# Altium schematic sheet Dual_LoadSwitch_Driver.SchDoc
size A4; SheetNumber: 9; SheetTotal: 14
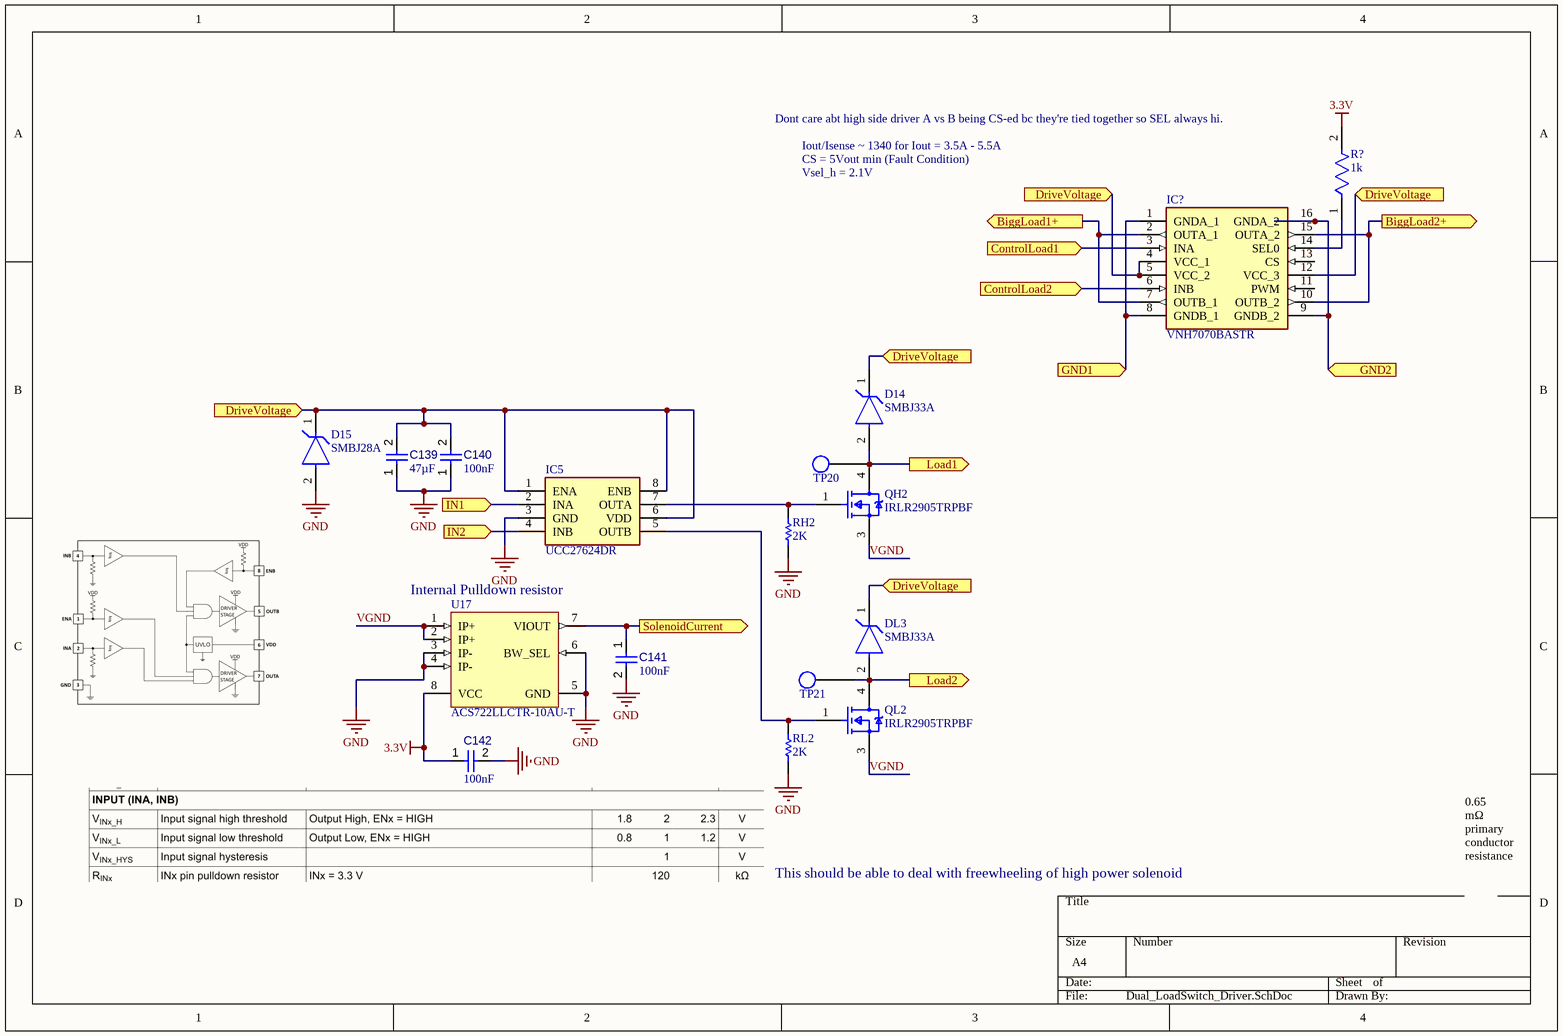
[diagram p0: Dual_LoadSwitch_Driver.SchDoc]

## Parts
C139  value 47µF  [CAPC0805(2012)145_L]  (hidden comment: Capacitor 47µF +/-40% 6.3V 0805)
C140  value 100nF  [CAPC2013X95X50LL10T25]  (hidden comment: Capacitor 100 nF +/-10% 50 V 0805)
C141  value 100nF  [CAPC1005X56X25LL10T15]  (hidden comment: Capacitor 0.1 uF +/- 5% 16 V 0402)
C142  value 100nF  [CAPC1005X56X25LL10T15]  (hidden comment: Capacitor 0.1 uF +/- 5% 16 V 0402)
D14  SMBJ33A  [FP-SMBJ-MFG]
D15  SMBJ28A  [FP-SMBJ-MFG]
DL3  SMBJ33A  [FP-SMBJ-MFG]
IC5  UCC27624DR  [SOIC127P600X175-8N]
IC?  VNH7070BASTR  [SOIC127P600X175-16N]
QH2  IRLR2905TRPBF  [FP-PG-TO252-3-MFG]
QL2  IRLR2905TRPBF  [FP-PG-TO252-3-MFG]
R?  1k  [FP-CRCW0603-e3-MFG]
RH2  2K  [RESC1609X50X30ML10T20]
RL2  2K  [RESC1609X50X30ML10T20]
TP20  BURPG_TestPoint1  [BURPG_TestPoint1]  (value not drawn)  (no BOM)
TP21  BURPG_TestPoint1  [BURPG_TestPoint1]  (value not drawn)  (no BOM)
U17  ACS722LLCTR-10AU-T  [ALEG-LC-8_V]

## Ports
BiggLoad1+ (out), BiggLoad2+ (out), ControlLoad1 (in), ControlLoad2 (in), DriveVoltage (in), GND1 (in), GND2 (in), IN1 (in), IN2 (in), Load1 (out), Load2 (out), SolenoidCurrent (out)

## Nets
3.3V: C142.1 R?.2 U17.8(VCC)
GND: C139.1 C140.1 C141.2 C142.2 D15.2(A) IC5.3(GND) RH2.1 RL2.1 U17.3(IP-) U17.4(IP-) U17.5(GND) U17.6(BW_SEL)
BiggLoad1+: IC?.2(OUTA_1) IC?.7(OUTB_1) ; port BiggLoad1+
BiggLoad2+: IC?.10(OUTB_2) IC?.15(OUTA_2) ; port BiggLoad2+
ControlLoad1: IC?.3(INA) ; port ControlLoad1
ControlLoad2: IC?.6(INB) ; port ControlLoad2
DriveVoltage: C139.2 C140.2 D14.1(C) D15.1(C) DL3.1(C) IC5.1(ENA) IC5.6(VDD) IC5.8(ENB) IC?.4(VCC_1) IC?.5(VCC_2) IC?.12(VCC_3) ; port DriveVoltage
GND1: IC?.1(GNDA_1) IC?.8(GNDB_1) ; port GND1
GND2: IC?.9(GNDB_2) IC?.16(GNDA_2) ; port GND2
IN1: IC5.2(INA) ; port IN1
IN2: IC5.4(INB) ; port IN2
Load1: D14.2(A) QH2.4(DRAIN) TP20.1 ; port Load1
Load2: DL3.2(A) QL2.4(DRAIN) TP21.1 ; port Load2
SolenoidCurrent: C141.1 U17.7(VIOUT) ; port SolenoidCurrent
VGND: QH2.3(SOURCE) QL2.3(SOURCE) U17.1(IP+) U17.2(IP+)
NetIC5_5: IC5.5(OUTB) QL2.1(GATE) RL2.2
NetIC5_7: IC5.7(OUTA) QH2.1(GATE) RH2.2
NetIC?_14: IC?.14(SEL0) R?.1

Not connected (* = marked no-connect by the designer): IC? 11(PWM) 13(CS)

## Notes on the sheet
- (near R?) Dont care abt high side driver A vs B being CS-ed bc they're tied together so SEL always hi.
- Iout/Isense ~ 1340 for Iout = 3.5A - 5.5A
- CS = 5Vout min (Fault Condition)
- Vsel_h = 2.1V
- (near U17) Internal Pulldown resistor
- This should be able to deal with freewheeling of high power solenoid
- 0.65 mΩ primary conductor resistance

## Library data of the parts
C139 = CMP-001-00082-4: Chip Capacitor, 47µF +/-40%, 6.3V, 0805, Thickness 1.45 mm; Tolerance: 10%; Min Operating Temperature: -55°C; Max Operating Temperature: 85°C; Case/Package: 0805; Pins: 2; Mounting Technology: SMT; Voltage Rating: 6.3V
C140 = CMP-001-00018-6: Chip Capacitor, 100 nF, +/- 10%, 50 V, 0805 (2012 Metric); Capacitor Type: Ceramic; Voltage Rating: 50V; Pins: 2; Max Operating Temperature: 125°C; Min Operating Temperature: -55°C; Mounting Technology: SM; Case/Package: 0805; RoHS Compliant: True; Tolerance: 10%
C141 C142 = CMP-001-00001-6: Chip Capacitor, 0.1 uF, +/- 5%, 16 V, 0402 (1005 Metric); Capacitor Type: Ceramic; Voltage Rating: 16V; Max Operating Temperature: 125°C; Min Operating Temperature: -55°C; Case/Package: 0402; Mounting Technology: SM; Pins: 2; Tolerance: 5%; RoHS Compliant: True
D14 DL3 = CMP-2000-07095-2: TVS DIODE 33V 53.3V DO214AA; Manufacturer: Littelfuse Inc; Max Junction Temp: +150°C; Number Of Channels: 1; Breakdown Voltage: 36.7V; Peak Pulse Power: 600W; Direction: Unidirectional; Peak Pulse Current: 11.3A; Lead Free: Yes; Height: 2.61mm; Temperature Range Low: -65°C; ComponentLink2URL: https://www.littelfuse.com/~/media/electronics/datasheets/tvs_diodes/littelfuse_tvs_diode_smbj_datasheet.pdf.pdf; Manufacturer Part Number: SMBJ33A; Clamping Voltage: 53.3V; Device Class L1: Circuit Protection; Octopart: https://octopart.com/smbj33a-littelfuse-350829; Device Class L2: TVS Diodes; Digikey Description: TVS DIODE 33V 53.3V DO214AA; Automotive: No; Temperature Range High: +150°C; Package: SMBJ; ComponentLink2Description: Datasheet; Mouser Description: TVS DIODE 33V 53.3V DO214AA; Reverse Standoff Voltage: 33V; Category: Diode; Device Class L3: unset; Temperature: -65°C to +150°C; RoHS: TRUE
D15 = CMP-08607-000081-1: TVS DIODE 28V 45.4V DO214AA; Manufacturer: Littelfuse Inc; Breakdown Voltage: 31.1V; Direction: Unidirectional; Number Of Channels: 1; Peak Pulse Power: 600W; Max Junction Temp: +150°C; Peak Pulse Current: 13.3A; Temperature: -65°C to +150°C; Category: Diode; RoHS: TRUE; Height: 2.61mm; Reverse Standoff Voltage: 28V; Device Class L1: Circuit Protection; Temperature Range Low: -65°C; ComponentLink2Description: Datasheet; Digikey Description: TVS DIODE 28V 45.4V DO214AA; Automotive: No; Package: SMBJ; Mouser Description: Littelfuse SMBJ28A, Uni-Directional TVS Diode, 600W, 2-Pin DO-214AA; ComponentLink2URL: https://www.littelfuse.com/~/media/electronics/datasheets/tvs_diodes/littelfuse_tvs_diode_smbj_datasheet.pdf.pdf; Manufacturer Part Number: SMBJ28A; Octopart: https://octopart.com/smbj28a-littelfuse-350790; Clamping Voltage: 45.4V; Temperature Range High: +150°C; Device Class L3: unset; Device Class L2: TVS Diodes; Lead Free: Yes
IC5 = UCC27624DR: Integrated Circuit; Manufacturer_Name: Texas Instruments; Datasheet Link: https://www.ti.com/lit/ds/symlink/ucc27624.pdf?ts=1654150888910&ref_url=https%253A%252F%252Fwww.ti.com%252Fproduct%252FUCC27624; Height: 1.75mm; Manufacturer_Part_Number: UCC27624DR; Mouser Part Number: 595-UCC27624DR; Mouser Price/Stock: https://www.mouser.co.uk/ProductDetail/Texas-Instruments/UCC27624DR?qs=Rp5uXu7WBW%2FHvRoPIZ55DQ%3D%3D; Arrow Part Number: UCC27624DR; Arrow Price/Stock: https://www.arrow.com/en/products/ucc27624dr/texas-instruments?utm_currency=USD&region=nac
IC? = VNH7070BASTR: Integrated Circuit; Manufacturer_Name: STMicroelectronics; Datasheet Link: https://rs.componentsearchengine.com/Datasheets/1/VNH7070BASTR.pdf; Height: 1.75mm; Manufacturer_Part_Number: VNH7070BASTR; Mouser Part Number: 511-VNH7070BASTR; Mouser Price/Stock: https://www.mouser.co.uk/ProductDetail/STMicroelectronics/VNH7070BASTR?qs=5aG0NVq1C4zvEdklLjnXpw%3D%3D; Arrow Part Number: VNH7070BASTR; Arrow Price/Stock: https://www.arrow.com/en/products/vnh7070bastr/stmicroelectronics?region=nac
QH2 QL2 = CMP-32901-000025-1: MOSFET N-CH 55V 42A DPAK; Manufacturer: Infineon Technologies; Reverse Recovery Time: 80ns; Threshold Vgs Min: 1V; Power Dissipation: 110W; Gate Charge At Vgs: 48nC @ 5V; Reverse Recovery Charge: 210nC; Turn On Delay Time: 11ns; Input Capacitace At Vds: 1700pF @ 25V; Rthja Max: 110°C/W; Turn Off Delay Time: 26ns; Number Of Channels: 1; Max Junction Temp: +175°C; Max Forward Diode Voltage: 1.3V; Threshold Vgs Max: 2V; Gate To Source Voltage: 16V; Pulse Drain Current: 160A; Drain To Source Resistance: 0.03Ω; Depletion Mode: False; RoHS: TRUE; Automotive: No; Device Class L3: MOSFETs; Drain To Source Breakdown Voltage: 55V; ComponentLink2URL: https://www.infineon.com/dgdl/irlr2905pbf.pdf?fileId=5546d462533600a40153566cc2bb2679; ComponentLink2Description: Datasheet; Device Class L1: Discrete Semiconductors; Temperature: -55°C to +175°C; Digikey Description: MOSFET N-CH 55V 42A DPAK; Device Class L2: Transistors; Temperature Range Low: -55°C; Manufacturer Part Number: IRLR2905TRPBF; Continuous Drain Current: 42A; Octopart: https://octopart.com/irlr2905trpbf-infineon-65875013; Drain To Source Voltage: 55V; Lead Free: Yes; Number Of N Channels: 1; Height: 2.52mm; Category: Trans; Package: PG-TO252-3; Temperature Range High: +175°C; Footprint Url: http://www.irf.com/package/hexfet/dpakfootprint.pdf
R? = CMP-1666-00003-5: RES Thick Film, 1kΩ, 1%, 0.1W, 100ppm/°C, 0603; Max Power Dissipation: 100mW; Voltage Rating: 75V; Resistance: 1kR; Max Operating Temperature: 155°C; Number of Pins: 2; Case Code (Imperial): 0603; Width: 0.033inch; Power Rating: 100mW; Number of Terminations: 2; Package Quantity: 10; Weight: 7.1E-05oz; Tolerance: 1%; Temperature Coefficient: 100ppm/°C; Military Standard: Not; Mount: Surface Mount; Voltage Rating (DC): 75V; Depth: 0.85mm; Composition: Thick Film; Radiation Hardening: No; Termination: SMD/SMT; Length: 1.55mm; Case Code (Metric): 1608; Contact Plating: Tin; Min Operating Temperature: -55°C; Packaging: Tape and Reel; Height: 0.45mm; Lead Free: Lead Free; Case/Package: 0603; Features: Automotive AEC-Q200
RH2 RL2 = CMP-2000-03159-1: 2K 0603 0.1w; Manufacturer: Vishay Dale; Part Number: CRCW06032K00FKEA
U17 = CMP-1557-00005-1: High Accuracy, Galvanically Isolated Current Sensor IC, 3 to 3.6 V, 0 to 10 A IP, -40 to 150 degC, 8-Pin SOIC (LC), RoHS, Tape and Reel; VCC Min: 3 V; VCC Max: 3.6 V; IP Min: 0 A; IP Max: 10 A; Temperature Min: -40 degC; ComponentLink1Description: Manufacturer URL; RoHS: TRUE; PackageDescription: 8-Pin Small Outline Integrated Package, Body 4.9 x 3.9 mm, Pitch 1.27 mm; ComponentLink3URL: http://www.allegromicro.com/~/media/Files/Datasheets/ACS711-Datasheet.ashx?la=en; ComponentLink2Description: Datasheet; ComponentLink2URL: http://www.allegromicro.com/~/media/Files/Datasheets/ACS722-Datasheet.ashx?la=en; ComponentLink1URL: http://www.allegromicro.com/; Packing: Tape and Reel; ComponentLink3Description: Package Specification; Temperature Max: 150 degC; PartNumber: ACS722LLCTR-10AU-T; Mounting Technology: Surface Mount